# EAGLE board circadian rev2.1 (EAGLE 9.6.2), part 1 of 2
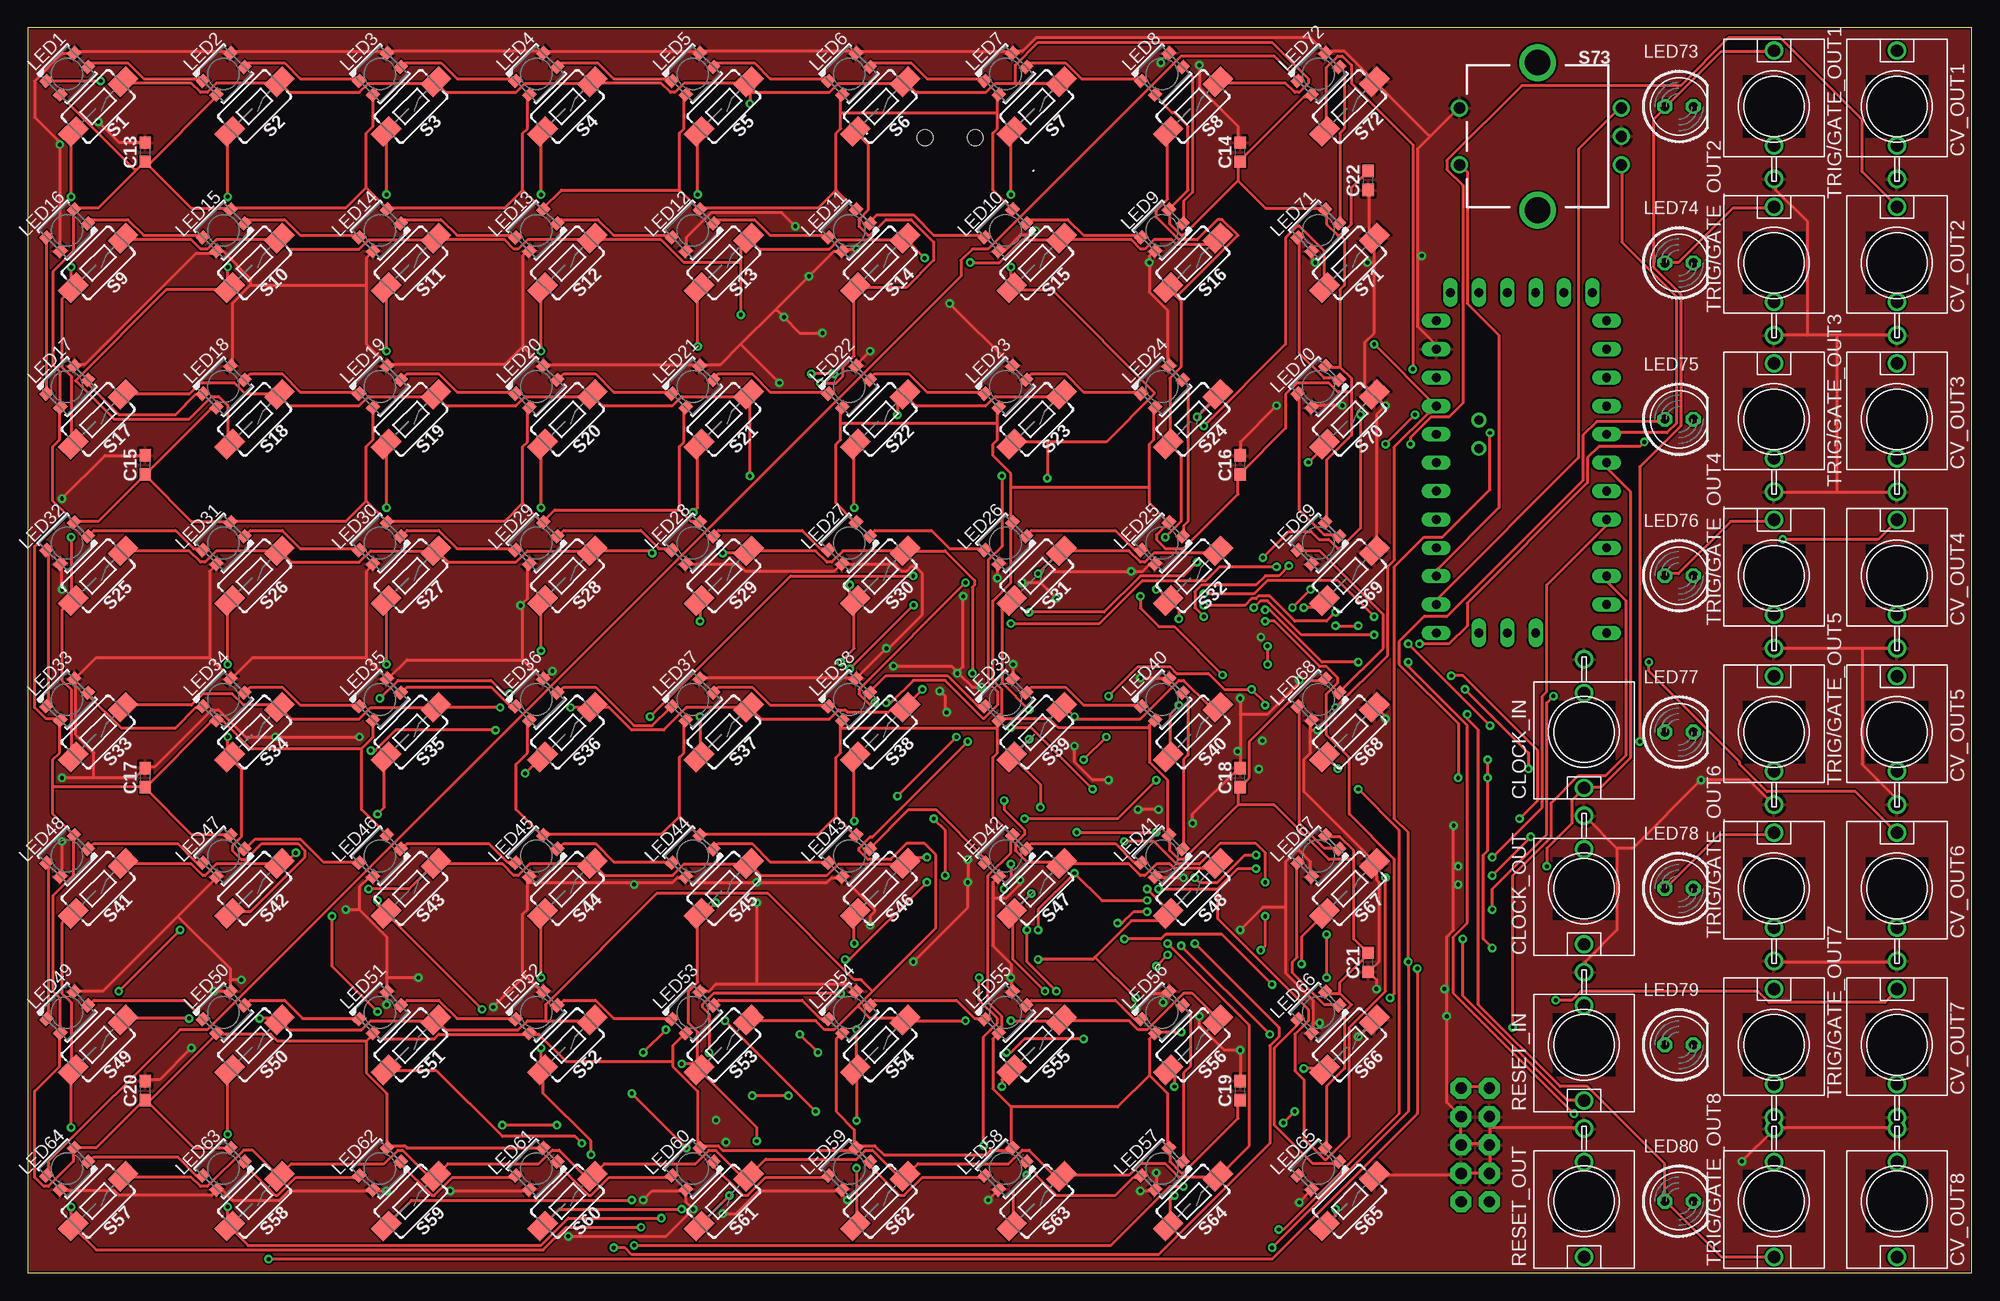
[diagram p6: board, top side]
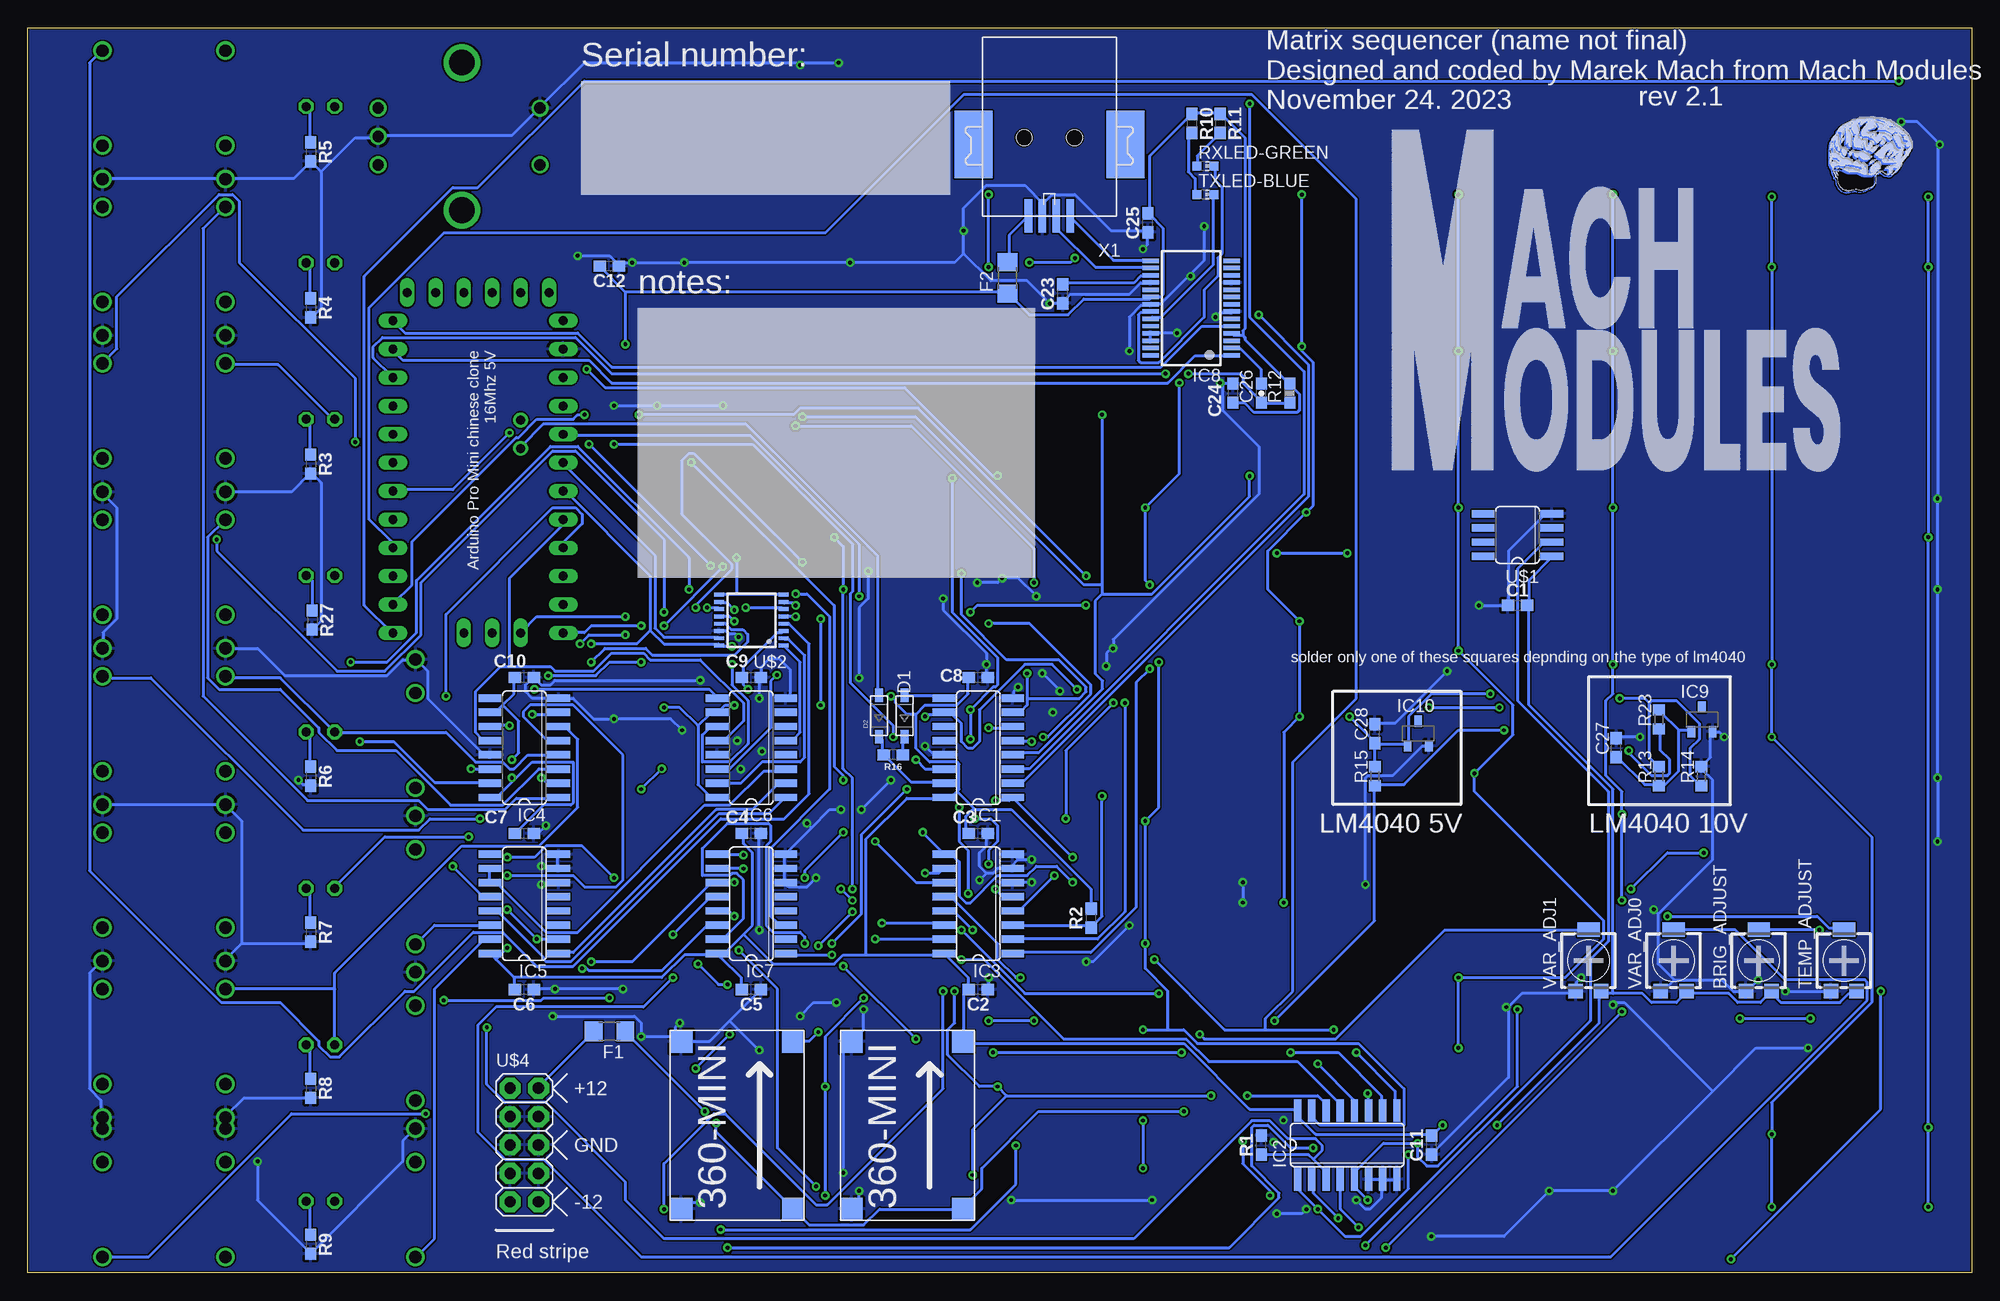
[diagram p7: board, bottom side, seen from below]

Size 173.97 x 111.43 mm. Coordinates in mm from the lower left corner, seen from the top.
Outline: 0,0 173.97,0 173.97,111.43 0,111.43 0,0
Copper layers (1*16): Top 0.035mm / dielectric 0.15mm / Bottom 0.035mm
Design rules "default *": minimum track width 6mil, minimum drill 0.35mm, track to track 6mil, track to pad 6mil, pad to pad 6mil, via to via 6mil, smd to smd 6mil, copper to edge 6mil, drill to drill 6mil, minimum pad ring 10mil, minimum via ring 8mil, stop-mask expansion 4mil, vias tented up to drill 50mil, thermal gap 10mil
Net classes: 0 default: width 0.254 mm; 1 LED_POWER: width 0.305 mm

## Footprints (pad centres in the part's own frame; a part is rotated, then mirrored left to right if it is on the bottom)
RTRIM4G/J = smd 1.3 x 1.3: 1 -1.15,-2.75; 3 1.15,-2.75 | smd 2 x 1.3: 2 0,2.75
0603 = smd 1.1 x 1: 1 -0.85,0; 2 0.85,0
0603-CAP = smd 1.1 x 1: 1 -0.85,0; 2 0.85,0
C0603 = smd 1.1 x 1: 1 -0.85,0; 2 0.85,0
WQP-PJ301M-12_JACK = drill 1.1: P$1 0,5; P$2 0,-3.5; P$3 0,-6.5
SOD-123 = smd 1.2 x 0.7: A 1.85,0; C -1.85,0
1206 = smd 1.6 x 1.803: 1 -1.422,0; 2 1.422,0
SO16 = smd 0.66 x 2.032: 1 -4.445,-3.073; 2 -3.175,-3.073; 3 -1.905,-3.073; 4 -0.635,-3.073; 5 0.635,-3.073; 6 1.905,-3.073; 7 3.175,-3.073; 8 4.445,-3.073; 9 4.445,3.073; 10 3.175,3.073; 11 1.905,3.073; 12 0.635,3.073; 13 -0.635,3.073; 14 -1.905,3.073; 15 -3.175,3.073; 16 -4.445,3.073
SSOP28 = smd 0.4 x 1.5: 1 -4.225,-3.625; 2 -3.575,-3.625; 3 -2.925,-3.625; 4 -2.275,-3.625; 5 -1.625,-3.625; 6 -0.975,-3.625; 7 -0.325,-3.625; 8 0.325,-3.625; 9 0.975,-3.625; 10 1.625,-3.625; 11 2.275,-3.625; 12 2.925,-3.625; 13 3.575,-3.625; 14 4.225,-3.625; 15 4.225,3.625; 16 3.575,3.625; 17 2.925,3.625; 18 2.275,3.625; 19 1.625,3.625; 20 0.975,3.625; 21 0.325,3.625; 22 -0.325,3.625; 23 -0.975,3.625; 24 -1.625,3.625; 25 -2.275,3.625; 26 -2.925,3.625; 27 -3.575,3.625; 28 -4.225,3.625
DBZ_R-PDSO-G3 = smd 0.7 x 1: 1 -0.95,-1.1; 2 0.95,-1.1; 3 0,1.1
LED3535 = smd 1 x 0.85: 1 -1.75,0.875; 2 -1.75,-0.875; 3 1.75,-0.875; 4 1.75,0.875
LED5MM = drill 0.813 octagon: A -1.27,0; K 1.27,0
0603-RES = smd 1.1 x 1: 1 -0.85,0; 2 0.85,0
R0603 = smd 1 x 1.1: 1 -0.85,0; 2 0.85,0
CHIP-LED0603 = smd 0.8 x 0.8: A 0,-0.75; C 0,0.75
TACTILE_SWITCH_SMD_6.0X3.5MM = smd 2.3 x 1.6: 1 -3.15,0; 2 3.15,0
ROTARY_ENC_PLAIN = drill 1.016: A 7.493,-2.54; B 7.493,2.54; C 7.493,0; SW+ -6.985,2.54; SW- -6.985,-2.54 | drill 2.286: P$3 0,6.604; P$4 0,-6.604
SO08 = smd 0.66 x 2.032: 1 -1.905,-3.073; 2 -0.635,-3.073; 3 0.635,-3.073; 4 1.905,-3.073; 5 1.905,3.073; 6 0.635,3.073; 7 -0.635,3.073; 8 -1.905,3.073
TSSOP-16 = smd 0.9 x 0.35: 1 -2.875,2.275; 2 -2.875,1.625; 3 -2.875,0.975; 4 -2.875,0.325; 5 -2.875,-0.325; 6 -2.875,-0.975; 7 -2.875,-1.625; 8 -2.875,-2.275; 9 2.875,-2.275; 10 2.875,-1.625; 11 2.875,-0.975; 12 2.875,-0.325; 13 2.875,0.325; 14 2.875,0.975; 15 2.875,1.625; 16 2.875,2.275
ABK-PRO-MINI = drill 0.8 long: A0 10.16,-11.43; A1 10.16,-8.89; A2 10.16,-6.35; A3 10.16,-3.81; A6 3.81,-21.59; A7 6.35,-21.59; D2 -5.08,-3.81; D3 -5.08,-6.35; D4 -5.08,-8.89; D5 -5.08,-11.43; D6 -5.08,-13.97; D7 -5.08,-16.51; D8 -5.08,-19.05; D9 -5.08,-21.59; D10 10.16,-21.59; D11 10.16,-19.05; D12 10.16,-16.51; D13 10.16,-13.97; DTR -3.81,8.89; GND 10.16,3.81; GND1 -5.08,-1.27; GND2 8.89,8.89; GND3 6.35,8.89; GND4 1.27,-21.59; RAW 10.16,6.35; RST 10.16,1.27; RST1 -5.08,1.27; RX1 -5.08,3.81; RX1-1 1.27,8.89; TX0 -5.08,6.35; TX0-1 -1.27,8.89; VCC 10.16,-1.27; VCC1 3.81,8.89 | drill 0.8: A4 6.35,-5.08; A5 6.35,-2.54
POWER_10 = drill 1.016 pad 1.88 octagon: 1 -5.08,-1.27; 2 -5.08,1.27; 3 -2.54,-1.27; 4 -2.54,1.27; 5 0,-1.27; 6 0,1.27; 7 2.54,-1.27; 8 2.54,1.27; 9 5.08,-1.27; 10 5.08,1.27
MINI-360SMD = smd 2 x 2: +IN -7,-5; +OUT 8,-5; -IN -7,5; -OUT 8,5
USB-B-SMT = smd 6.04 x 3.4: 5 0.58,6.8; 6 0.58,-6.8 | smd 3 x 0.7: D+ 7,1.875; D- 7,0.625; GND 7,-0.625; VUSB 7,-1.875 | hole 1.4: 0,2.25; 0,-2.25

## Placement (x,y rotation side)
BRIG_ADJUST  [RTRIM4G/J]  19.05,27.94 0 bottom
C1  0.1uF  [0603]  40.64,59.75 0 bottom
C2  0.1uF  [0603]  88.9,25.34 180 bottom
C3  0.1uF  [0603]  88.9,39.31 180 bottom
C4  0.1uF  [0603]  109.22,39.31 180 bottom
C5  0.1uF  [0603]  109.22,25.34 180 bottom
C6  0.1uF  [0603]  129.54,25.34 180 bottom
C7  0.1uF  [0603]  129.54,39.31 180 bottom
C8  0.1uF  [0603]  88.9,53.28 180 bottom
C9  0.1uF  [0603]  109.22,53.28 180 bottom
C10  0.1uF  [0603]  129.54,53.28 180 bottom
C11  0.1uF  [0603]  48.32,11.43 90 bottom
C12  0.1uF  [0603]  121.92,90.11 180 bottom
C13  0.1uF  [0603]  10.51,100.31 90 top
C14  0.1uF  [0603]  108.51,100.31 90 top
C15  0.1uF  [0603]  10.51,72.31 90 top
C16  0.1uF  [0603]  108.51,72.31 90 top
C17  0.1uF  [0603]  10.51,44.31 90 top
C18  0.1uF  [0603]  108.51,44.31 90 top
C19  0.1uF  [0603]  108.51,16.31 90 top
C20  0.1uF  [0603]  10.51,16.31 90 top
C21  0.1uF  [0603]  119.97,27.77 90 top
C22  0.1uF  [0603]  119.97,97.77 90 top
C23  0.1uF  [0603]  81.34,87.63 90 bottom
C24  10uF  [0603]  66.1,78.74 90 bottom
C25  0.1uF  [0603]  73.72,93.98 90 bottom
C26  100n  [0603-CAP]  63.56,78.74 90 bottom
C27  470n  [C0603]  31.81,46.99 90 bottom
C28  470n  [C0603]  53.4,48.26 90 bottom
CLOCK_IN  WQP-PJ301M-12_JACK  [WQP-PJ301M-12_JACK]  139.28,48.4 180 top
CLOCK_OUT  WQP-PJ301M-12_JACK  [WQP-PJ301M-12_JACK]  139.28,34.4 180 top
CV_OUT1  WQP-PJ301M-12_JACK  [WQP-PJ301M-12_JACK]  167.29,104.4 0 top
CV_OUT2  WQP-PJ301M-12_JACK  [WQP-PJ301M-12_JACK]  167.29,90.4 0 top
CV_OUT3  WQP-PJ301M-12_JACK  [WQP-PJ301M-12_JACK]  167.29,76.4 0 top
CV_OUT4  WQP-PJ301M-12_JACK  [WQP-PJ301M-12_JACK]  167.29,62.4 0 top
CV_OUT5  WQP-PJ301M-12_JACK  [WQP-PJ301M-12_JACK]  167.29,48.4 0 top
CV_OUT6  WQP-PJ301M-12_JACK  [WQP-PJ301M-12_JACK]  167.29,34.4 0 top
CV_OUT7  WQP-PJ301M-12_JACK  [WQP-PJ301M-12_JACK]  167.29,20.4 0 top
CV_OUT8  WQP-PJ301M-12_JACK  [WQP-PJ301M-12_JACK]  167.29,6.4 180 top
D1  [SOD-123]  95.51,49.85 90 bottom
D2  [SOD-123]  97.79,49.85 90 bottom
F1  PTC-FUSE  [1206]  121.92,21.59 180 bottom
F2  PTC-FUSE  [1206]  86.3,89.05 90 bottom
IC1  4017D  [SO16]  88.9,46.99 90 bottom
IC2  4051D  [SO16]  55.88,11.43 0 bottom
IC3  4051D  [SO16]  88.9,33.02 90 bottom
IC4  74HC595D  [SO16]  129.54,46.99 90 bottom
IC5  4053D  [SO16]  129.54,33.02 90 bottom
IC6  74HC595D  [SO16]  109.22,46.99 90 bottom
IC7  4051D  [SO16]  109.22,33.02 90 bottom
IC8  FT232RL  [SSOP28]  69.85,86.36 90 bottom
IC9  LM4040B10  [DBZ_R-PDSO-G3]  24.13,49.53 0 bottom
IC10  LM4040B05  [DBZ_R-PDSO-G3]  49.53,48.26 0 bottom
LED1  SK68123535  [LED3535]  3.51,107.31 45 top
LED2  SK68123535  [LED3535]  17.51,107.31 45 top
LED3  SK68123535  [LED3535]  31.51,107.31 45 top
LED4  SK68123535  [LED3535]  45.51,107.31 45 top
LED5  SK68123535  [LED3535]  59.51,107.31 45 top
LED6  SK68123535  [LED3535]  73.51,107.31 45 top
LED7  SK68123535  [LED3535]  87.51,107.31 45 top
LED8  SK68123535  [LED3535]  101.51,107.31 45 top
LED9  SK68123535  [LED3535]  101.51,93.31 225 top
LED10  SK68123535  [LED3535]  87.51,93.31 225 top
LED11  SK68123535  [LED3535]  73.51,93.31 225 top
LED12  SK68123535  [LED3535]  59.51,93.31 225 top
LED13  SK68123535  [LED3535]  45.51,93.31 225 top
LED14  SK68123535  [LED3535]  31.51,93.31 225 top
LED15  SK68123535  [LED3535]  17.51,93.31 225 top
LED16  SK68123535  [LED3535]  3.51,93.31 225 top
LED17  SK68123535  [LED3535]  3.51,79.31 45 top
LED18  SK68123535  [LED3535]  17.51,79.31 45 top
LED19  SK68123535  [LED3535]  31.51,79.31 45 top
LED20  SK68123535  [LED3535]  45.51,79.31 45 top
LED21  SK68123535  [LED3535]  59.51,79.31 45 top
LED22  SK68123535  [LED3535]  73.51,79.31 45 top
LED23  SK68123535  [LED3535]  87.51,79.31 45 top
LED24  SK68123535  [LED3535]  101.51,79.31 45 top
LED25  SK68123535  [LED3535]  101.51,65.31 225 top
LED26  SK68123535  [LED3535]  87.51,65.31 225 top
LED27  SK68123535  [LED3535]  73.51,65.31 225 top
LED28  SK68123535  [LED3535]  59.51,65.31 225 top
LED29  SK68123535  [LED3535]  45.51,65.31 225 top
LED30  SK68123535  [LED3535]  31.51,65.31 225 top
LED31  SK68123535  [LED3535]  17.51,65.31 225 top
LED32  SK68123535  [LED3535]  3.51,65.31 225 top
LED33  SK68123535  [LED3535]  3.51,51.31 45 top
LED34  SK68123535  [LED3535]  17.51,51.31 45 top
LED35  SK68123535  [LED3535]  31.51,51.31 45 top
LED36  SK68123535  [LED3535]  45.51,51.31 45 top
LED37  SK68123535  [LED3535]  59.51,51.31 45 top
LED38  SK68123535  [LED3535]  73.51,51.31 45 top
LED39  SK68123535  [LED3535]  87.51,51.31 45 top
LED40  SK68123535  [LED3535]  101.51,51.31 45 top
LED41  SK68123535  [LED3535]  101.51,37.31 225 top
LED42  SK68123535  [LED3535]  87.51,37.31 225 top
LED43  SK68123535  [LED3535]  73.51,37.31 225 top
LED44  SK68123535  [LED3535]  59.51,37.31 225 top
LED45  SK68123535  [LED3535]  45.51,37.31 225 top
LED46  SK68123535  [LED3535]  31.51,37.31 225 top
LED47  SK68123535  [LED3535]  17.51,37.31 225 top
LED48  SK68123535  [LED3535]  3.51,37.31 225 top
LED49  SK68123535  [LED3535]  3.51,23.31 45 top
LED50  SK68123535  [LED3535]  17.51,23.31 45 top
LED51  SK68123535  [LED3535]  31.51,23.31 45 top
LED52  SK68123535  [LED3535]  45.51,23.31 45 top
LED53  SK68123535  [LED3535]  59.51,23.31 45 top
LED54  SK68123535  [LED3535]  73.51,23.31 45 top
LED55  SK68123535  [LED3535]  87.51,23.31 45 top
LED56  SK68123535  [LED3535]  101.51,23.31 45 top
LED57  SK68123535  [LED3535]  101.51,9.31 225 top
LED58  SK68123535  [LED3535]  87.51,9.31 225 top
LED59  SK68123535  [LED3535]  73.51,9.31 225 top
LED60  SK68123535  [LED3535]  59.51,9.31 225 top
LED61  SK68123535  [LED3535]  45.51,9.31 225 top
LED62  SK68123535  [LED3535]  31.51,9.31 225 top
LED63  SK68123535  [LED3535]  17.51,9.31 225 top
LED64  SK68123535  [LED3535]  3.51,9.31 225 top
LED65  SK68123535  [LED3535]  115.51,9.31 225 top
LED66  SK68123535  [LED3535]  115.51,23.31 225 top
LED67  SK68123535  [LED3535]  115.51,37.31 225 top
LED68  SK68123535  [LED3535]  115.51,51.31 225 top
LED69  SK68123535  [LED3535]  115.51,65.31 225 top
LED70  SK68123535  [LED3535]  115.51,79.31 225 top
LED71  SK68123535  [LED3535]  115.51,93.31 225 top
LED72  SK68123535  [LED3535]  115.51,107.31 45 top
LED73  [LED5MM]  147.79,104.4 0 top
LED74  [LED5MM]  147.79,90.4 0 top
LED75  [LED5MM]  147.79,76.4 0 top
LED76  [LED5MM]  147.79,62.4 0 top
LED77  [LED5MM]  147.79,48.4 0 top
LED78  [LED5MM]  147.79,34.4 0 top
LED79  [LED5MM]  147.79,20.4 0 top
LED80  [LED5MM]  147.79,6.4 0 top
R1  10k  [0603]  63.56,11.43 90 bottom
R2  10k  [0603]  78.8,31.75 90 bottom
R3  470  [0603]  148.65,72.39 270 bottom
R4  470  [0603]  148.65,86.36 270 bottom
R5  470  [0603]  148.65,100.33 270 bottom
R6  470  [0603]  148.65,44.45 270 bottom
R7  470  [0603]  148.65,30.48 270 bottom
R8  470  [0603]  148.65,16.51 270 bottom
R9  470  [0603]  148.65,2.54 270 bottom
R10  470  [0603]  69.79,102.87 270 bottom
R11  470  [0603]  67.25,102.87 270 bottom
R12  10K  [0603-RES]  61.02,78.74 90 bottom
R13  1.0k  [R0603]  28,44.45 90 bottom
R14  1.0k  [R0603]  24.19,44.45 90 bottom
R15  1.0k  [R0603]  53.4,44.45 90 bottom
R16  1k  [0603]  96.52,46.35 180 bottom
R23  1.0k  [R0603]  28,49.53 90 bottom
R27  470  [0603]  148.53,58.42 270 bottom
RESET_IN  WQP-PJ301M-12_JACK  [WQP-PJ301M-12_JACK]  139.28,20.4 180 top
RESET_OUT  WQP-PJ301M-12_JACK  [WQP-PJ301M-12_JACK]  139.28,6.4 180 top
RXLED-GREEN  [CHIP-LED0603]  68.58,99.06 270 bottom
S1  MOMENTARY-SWITCH-SPST-SMD-6.0X3.5MM  [TACTILE_SWITCH_SMD_6.0X3.5MM]  6.29,104.4 225 top
S2  MOMENTARY-SWITCH-SPST-SMD-6.0X3.5MM  [TACTILE_SWITCH_SMD_6.0X3.5MM]  20.29,104.4 225 top
S3  MOMENTARY-SWITCH-SPST-SMD-6.0X3.5MM  [TACTILE_SWITCH_SMD_6.0X3.5MM]  34.29,104.4 225 top
S4  MOMENTARY-SWITCH-SPST-SMD-6.0X3.5MM  [TACTILE_SWITCH_SMD_6.0X3.5MM]  48.29,104.4 225 top
S5  MOMENTARY-SWITCH-SPST-SMD-6.0X3.5MM  [TACTILE_SWITCH_SMD_6.0X3.5MM]  62.29,104.4 225 top
S6  MOMENTARY-SWITCH-SPST-SMD-6.0X3.5MM  [TACTILE_SWITCH_SMD_6.0X3.5MM]  76.29,104.4 225 top
S7  MOMENTARY-SWITCH-SPST-SMD-6.0X3.5MM  [TACTILE_SWITCH_SMD_6.0X3.5MM]  90.29,104.4 225 top
S8  MOMENTARY-SWITCH-SPST-SMD-6.0X3.5MM  [TACTILE_SWITCH_SMD_6.0X3.5MM]  104.29,104.4 225 top
S9  MOMENTARY-SWITCH-SPST-SMD-6.0X3.5MM  [TACTILE_SWITCH_SMD_6.0X3.5MM]  6.29,90.4 225 top
S10  MOMENTARY-SWITCH-SPST-SMD-6.0X3.5MM  [TACTILE_SWITCH_SMD_6.0X3.5MM]  20.29,90.4 225 top
S11  MOMENTARY-SWITCH-SPST-SMD-6.0X3.5MM  [TACTILE_SWITCH_SMD_6.0X3.5MM]  34.29,90.4 225 top
S12  MOMENTARY-SWITCH-SPST-SMD-6.0X3.5MM  [TACTILE_SWITCH_SMD_6.0X3.5MM]  48.29,90.4 225 top
S13  MOMENTARY-SWITCH-SPST-SMD-6.0X3.5MM  [TACTILE_SWITCH_SMD_6.0X3.5MM]  62.29,90.4 225 top
S14  MOMENTARY-SWITCH-SPST-SMD-6.0X3.5MM  [TACTILE_SWITCH_SMD_6.0X3.5MM]  76.29,90.4 225 top
S15  MOMENTARY-SWITCH-SPST-SMD-6.0X3.5MM  [TACTILE_SWITCH_SMD_6.0X3.5MM]  90.29,90.4 225 top
S16  MOMENTARY-SWITCH-SPST-SMD-6.0X3.5MM  [TACTILE_SWITCH_SMD_6.0X3.5MM]  104.29,90.4 225 top
S17  MOMENTARY-SWITCH-SPST-SMD-6.0X3.5MM  [TACTILE_SWITCH_SMD_6.0X3.5MM]  6.29,76.4 225 top
S18  MOMENTARY-SWITCH-SPST-SMD-6.0X3.5MM  [TACTILE_SWITCH_SMD_6.0X3.5MM]  20.29,76.4 225 top
S19  MOMENTARY-SWITCH-SPST-SMD-6.0X3.5MM  [TACTILE_SWITCH_SMD_6.0X3.5MM]  34.29,76.4 225 top
S20  MOMENTARY-SWITCH-SPST-SMD-6.0X3.5MM  [TACTILE_SWITCH_SMD_6.0X3.5MM]  48.29,76.4 225 top
S21  MOMENTARY-SWITCH-SPST-SMD-6.0X3.5MM  [TACTILE_SWITCH_SMD_6.0X3.5MM]  62.29,76.4 225 top
S22  MOMENTARY-SWITCH-SPST-SMD-6.0X3.5MM  [TACTILE_SWITCH_SMD_6.0X3.5MM]  76.29,76.4 225 top
S23  MOMENTARY-SWITCH-SPST-SMD-6.0X3.5MM  [TACTILE_SWITCH_SMD_6.0X3.5MM]  90.29,76.4 225 top
S24  MOMENTARY-SWITCH-SPST-SMD-6.0X3.5MM  [TACTILE_SWITCH_SMD_6.0X3.5MM]  104.29,76.4 225 top
S25  MOMENTARY-SWITCH-SPST-SMD-6.0X3.5MM  [TACTILE_SWITCH_SMD_6.0X3.5MM]  6.29,62.4 225 top
S26  MOMENTARY-SWITCH-SPST-SMD-6.0X3.5MM  [TACTILE_SWITCH_SMD_6.0X3.5MM]  20.29,62.4 225 top
S27  MOMENTARY-SWITCH-SPST-SMD-6.0X3.5MM  [TACTILE_SWITCH_SMD_6.0X3.5MM]  34.29,62.4 225 top
S28  MOMENTARY-SWITCH-SPST-SMD-6.0X3.5MM  [TACTILE_SWITCH_SMD_6.0X3.5MM]  48.29,62.4 225 top
S29  MOMENTARY-SWITCH-SPST-SMD-6.0X3.5MM  [TACTILE_SWITCH_SMD_6.0X3.5MM]  62.29,62.4 225 top
S30  MOMENTARY-SWITCH-SPST-SMD-6.0X3.5MM  [TACTILE_SWITCH_SMD_6.0X3.5MM]  76.29,62.4 225 top
S31  MOMENTARY-SWITCH-SPST-SMD-6.0X3.5MM  [TACTILE_SWITCH_SMD_6.0X3.5MM]  90.29,62.4 225 top
S32  MOMENTARY-SWITCH-SPST-SMD-6.0X3.5MM  [TACTILE_SWITCH_SMD_6.0X3.5MM]  104.29,62.4 225 top
S33  MOMENTARY-SWITCH-SPST-SMD-6.0X3.5MM  [TACTILE_SWITCH_SMD_6.0X3.5MM]  6.29,48.4 225 top
S34  MOMENTARY-SWITCH-SPST-SMD-6.0X3.5MM  [TACTILE_SWITCH_SMD_6.0X3.5MM]  20.29,48.4 225 top
S35  MOMENTARY-SWITCH-SPST-SMD-6.0X3.5MM  [TACTILE_SWITCH_SMD_6.0X3.5MM]  34.29,48.4 225 top
S36  MOMENTARY-SWITCH-SPST-SMD-6.0X3.5MM  [TACTILE_SWITCH_SMD_6.0X3.5MM]  48.29,48.4 225 top
S37  MOMENTARY-SWITCH-SPST-SMD-6.0X3.5MM  [TACTILE_SWITCH_SMD_6.0X3.5MM]  62.29,48.4 225 top
S38  MOMENTARY-SWITCH-SPST-SMD-6.0X3.5MM  [TACTILE_SWITCH_SMD_6.0X3.5MM]  76.29,48.4 225 top
S39  MOMENTARY-SWITCH-SPST-SMD-6.0X3.5MM  [TACTILE_SWITCH_SMD_6.0X3.5MM]  90.29,48.4 225 top
S40  MOMENTARY-SWITCH-SPST-SMD-6.0X3.5MM  [TACTILE_SWITCH_SMD_6.0X3.5MM]  104.29,48.4 225 top
S41  MOMENTARY-SWITCH-SPST-SMD-6.0X3.5MM  [TACTILE_SWITCH_SMD_6.0X3.5MM]  6.29,34.4 225 top
S42  MOMENTARY-SWITCH-SPST-SMD-6.0X3.5MM  [TACTILE_SWITCH_SMD_6.0X3.5MM]  20.29,34.4 225 top
S43  MOMENTARY-SWITCH-SPST-SMD-6.0X3.5MM  [TACTILE_SWITCH_SMD_6.0X3.5MM]  34.29,34.4 225 top
S44  MOMENTARY-SWITCH-SPST-SMD-6.0X3.5MM  [TACTILE_SWITCH_SMD_6.0X3.5MM]  48.29,34.4 225 top
S45  MOMENTARY-SWITCH-SPST-SMD-6.0X3.5MM  [TACTILE_SWITCH_SMD_6.0X3.5MM]  62.29,34.4 225 top
S46  MOMENTARY-SWITCH-SPST-SMD-6.0X3.5MM  [TACTILE_SWITCH_SMD_6.0X3.5MM]  76.29,34.4 225 top
S47  MOMENTARY-SWITCH-SPST-SMD-6.0X3.5MM  [TACTILE_SWITCH_SMD_6.0X3.5MM]  90.29,34.4 225 top
S48  MOMENTARY-SWITCH-SPST-SMD-6.0X3.5MM  [TACTILE_SWITCH_SMD_6.0X3.5MM]  104.29,34.4 225 top
S49  MOMENTARY-SWITCH-SPST-SMD-6.0X3.5MM  [TACTILE_SWITCH_SMD_6.0X3.5MM]  6.29,20.4 225 top
S50  MOMENTARY-SWITCH-SPST-SMD-6.0X3.5MM  [TACTILE_SWITCH_SMD_6.0X3.5MM]  20.29,20.4 225 top
S51  MOMENTARY-SWITCH-SPST-SMD-6.0X3.5MM  [TACTILE_SWITCH_SMD_6.0X3.5MM]  34.29,20.4 225 top
S52  MOMENTARY-SWITCH-SPST-SMD-6.0X3.5MM  [TACTILE_SWITCH_SMD_6.0X3.5MM]  48.29,20.4 225 top
S53  MOMENTARY-SWITCH-SPST-SMD-6.0X3.5MM  [TACTILE_SWITCH_SMD_6.0X3.5MM]  62.29,20.4 225 top
S54  MOMENTARY-SWITCH-SPST-SMD-6.0X3.5MM  [TACTILE_SWITCH_SMD_6.0X3.5MM]  76.29,20.4 225 top
S55  MOMENTARY-SWITCH-SPST-SMD-6.0X3.5MM  [TACTILE_SWITCH_SMD_6.0X3.5MM]  90.29,20.4 225 top
S56  MOMENTARY-SWITCH-SPST-SMD-6.0X3.5MM  [TACTILE_SWITCH_SMD_6.0X3.5MM]  104.29,20.4 225 top
S57  MOMENTARY-SWITCH-SPST-SMD-6.0X3.5MM  [TACTILE_SWITCH_SMD_6.0X3.5MM]  6.29,6.4 225 top
S58  MOMENTARY-SWITCH-SPST-SMD-6.0X3.5MM  [TACTILE_SWITCH_SMD_6.0X3.5MM]  20.29,6.4 225 top
S59  MOMENTARY-SWITCH-SPST-SMD-6.0X3.5MM  [TACTILE_SWITCH_SMD_6.0X3.5MM]  34.29,6.4 225 top
S60  MOMENTARY-SWITCH-SPST-SMD-6.0X3.5MM  [TACTILE_SWITCH_SMD_6.0X3.5MM]  48.29,6.4 225 top
S61  MOMENTARY-SWITCH-SPST-SMD-6.0X3.5MM  [TACTILE_SWITCH_SMD_6.0X3.5MM]  62.29,6.4 225 top
S62  MOMENTARY-SWITCH-SPST-SMD-6.0X3.5MM  [TACTILE_SWITCH_SMD_6.0X3.5MM]  76.29,6.4 225 top
S63  MOMENTARY-SWITCH-SPST-SMD-6.0X3.5MM  [TACTILE_SWITCH_SMD_6.0X3.5MM]  90.29,6.4 225 top
S64  MOMENTARY-SWITCH-SPST-SMD-6.0X3.5MM  [TACTILE_SWITCH_SMD_6.0X3.5MM]  104.29,6.4 225 top
S65  MOMENTARY-SWITCH-SPST-SMD-6.0X3.5MM  [TACTILE_SWITCH_SMD_6.0X3.5MM]  118.29,6.4 225 top
S66  MOMENTARY-SWITCH-SPST-SMD-6.0X3.5MM  [TACTILE_SWITCH_SMD_6.0X3.5MM]  118.29,20.4 225 top
S67  MOMENTARY-SWITCH-SPST-SMD-6.0X3.5MM  [TACTILE_SWITCH_SMD_6.0X3.5MM]  118.29,34.4 225 top
S68  MOMENTARY-SWITCH-SPST-SMD-6.0X3.5MM  [TACTILE_SWITCH_SMD_6.0X3.5MM]  118.29,48.4 225 top
S69  MOMENTARY-SWITCH-SPST-SMD-6.0X3.5MM  [TACTILE_SWITCH_SMD_6.0X3.5MM]  118.29,62.4 225 top
S70  MOMENTARY-SWITCH-SPST-SMD-6.0X3.5MM  [TACTILE_SWITCH_SMD_6.0X3.5MM]  118.29,76.4 225 top
S71  MOMENTARY-SWITCH-SPST-SMD-6.0X3.5MM  [TACTILE_SWITCH_SMD_6.0X3.5MM]  118.29,90.4 225 top
S72  MOMENTARY-SWITCH-SPST-SMD-6.0X3.5MM  [TACTILE_SWITCH_SMD_6.0X3.5MM]  118.29,104.4 225 top
S73  ENCODER-SWITCH  [ROTARY_ENC_PLAIN]  135.13,101.72 0 top
TEMP_ADJUST  [RTRIM4G/J]  11.43,27.94 0 bottom
TRIG/GATE_OUT1  WQP-PJ301M-12_JACK  [WQP-PJ301M-12_JACK]  156.29,104.4 0 top
TRIG/GATE_OUT2  WQP-PJ301M-12_JACK  [WQP-PJ301M-12_JACK]  156.29,90.4 0 top
TRIG/GATE_OUT3  WQP-PJ301M-12_JACK  [WQP-PJ301M-12_JACK]  156.29,76.4 0 top
TRIG/GATE_OUT4  WQP-PJ301M-12_JACK  [WQP-PJ301M-12_JACK]  156.29,62.4 0 top
TRIG/GATE_OUT5  WQP-PJ301M-12_JACK  [WQP-PJ301M-12_JACK]  156.29,48.4 0 top
TRIG/GATE_OUT6  WQP-PJ301M-12_JACK  [WQP-PJ301M-12_JACK]  156.29,34.4 0 top
TRIG/GATE_OUT7  WQP-PJ301M-12_JACK  [WQP-PJ301M-12_JACK]  156.29,20.4 0 top
TRIG/GATE_OUT8  WQP-PJ301M-12_JACK  [WQP-PJ301M-12_JACK]  156.29,6.4 180 top
TXLED-BLUE  [CHIP-LED0603]  68.58,96.52 270 bottom
U$1  AD22100  [SO08]  40.64,66.04 90 bottom
U$2  AD5328  [TSSOP-16]  109.22,58.42 180 bottom
U$3  ABK-PRO-MINI  [ABK-PRO-MINI]  136.22,78.86 0 bottom
U$4  POWER_SIMPLE10  [POWER_10]  129.54,11.43 90 bottom
U$5  MINI-360SMD  [MINI-360SMD]  110.49,12.7 90 bottom
U$6  MINI-360SMD  [MINI-360SMD]  95.25,12.7 90 bottom
VAR_ADJ0  [RTRIM4G/J]  26.67,27.94 0 bottom
VAR_ADJ1  [RTRIM4G/J]  34.29,27.94 0 bottom
X1  [USB-B-SMT]  82.55,101.6 270 bottom

## Tracks (layer width: path | path; a pad name or v marks a point on that pad's centre or on a via)
5V_REF  (via drill 0.35)
  Top 0.254: v43.08,51.82 42.67,51.82 41.45,53.03 33.12,53.03 v31.5,51.41 | v119.28,76.81 119.28,66.65 117.45,64.82 117.25,64.82 116.43,65.63 115.57,65.63 114.85,66.36 112.89,66.36 v110.54,64.01 | v79.25,62.38 68.28,62.38 v55.68,49.78
  Bottom 0.254: 110.54,60.76 111.96,60.76 U$2.9 | 110.54,60.76 106.48,60.76 U$2.8 | C28.1 53.24,47.35 50.6,47.35 IC10.1 50.39,47.35 50.39,49.78 48.36,51.82 v43.08,51.82 | R15.2 53.44,45.31 53.44,47.35 C28.1 | 28.85,51 28.65,51.21 26.42,51.21 24.38,49.17 24.38,47.75 25.2,46.94 25.2,44.5 24.38,43.69 R14.1 | 28.85,51 28.85,46.13 28.04,45.31 R13.2 | v31.5,51.41 29.26,51.41 28.85,51 | v110.54,64.01 110.54,60.76 | v119.28,76.81 105.46,76.81 104.85,77.42 94.28,77.42 v79.25,62.38 | v55.68,49.78 53.44,47.55 C28.1
+5V  (via drill 0.35)
  Top 0.254: v120.5,83.11 125.98,77.62 U$3.VCC 125.98,77.42 125.58,77.01 125.37,77.01 122.33,73.97 122.33,63.8 121.72,63.2 121.72,55.27 v117.04,50.6 | v110.74,50.8 110.74,51 v109.53,52.22 107.09,52.22 105.66,53.65 102.82,53.65 102.21,54.25 99.36,54.25 v96.72,51.61 | v130.66,45.92 v130.66,44.3 130.66,37.8 130.25,37.39 130.25,29.87 v131.06,29.06 | v47.35,13.21 v42.47,13.21
  Bottom 0.254: 65.23,83.92 65.02,83.72 65.02,83.52 61.16,79.65 R12.2 60.96,79.45 60.15,78.64 60.15,77.22 60.35,77.01 64.21,77.01 65.02,77.83 66.04,77.83 C24.1 | 65.23,83.92 66.04,83.92 IC8.4 | 65.23,83.92 65.23,84.33 65.02,84.53 65.02,101.6 67.06,103.63 R11.1 67.26,103.83 69.7,103.83 R10.1 69.9,103.63 73.56,99.97 73.56,94.89 C25.2 73.56,94.69 72.34,93.47 72.34,87.58 72.54,87.38 73.36,87.38 IC8.20 73.56,87.17 79.45,87.17 80.87,85.75 84.33,85.75 86.16,87.58 F2.1 86.36,87.78 120.5,87.78 | 120.5,87.78 122.73,90.02 C12.2 | 120.5,87.78 v120.5,83.11 | U$1.1 37.59,64.01 39.62,61.98 39.62,59.94 C1.2 39.62,59.74 39.62,50.8 32.11,43.28 32.11,24.99 | TEMP_ADJUST.3 10.36,24.99 10.97,24.99 11.79,24.18 17.07,24.18 17.88,24.99 BRIG_ADJUST.3 18.09,24.99 18.9,24.18 20.93,24.18 21.74,24.99 25.4,24.99 VAR_ADJ0.3 25.6,24.99 26.42,24.18 28.65,24.18 29.46,24.99 32.11,24.99 | 32.11,24.99 33.12,24.99 VAR_ADJ1.3 33.33,24.99 33.33,22.35 v42.47,13.21 | U$2.3 106.48,57.3 106.88,57.3 109.93,54.25 109.93,53.44 C9.2 109.93,53.24 109.93,52.63 v109.53,52.22 | 114,48.97 114,43.69 112.98,42.67 112.37,42.67 IC6.16 | 114,48.97 112.98,49.99 112.37,49.99 IC6.10 112.17,50.19 111.56,50.8 v110.74,50.8 | 94.49,49.99 93.67,50.8 90.83,50.8 89.81,51.82 89.81,53.24 C8.2 | 94.49,49.99 94.49,46.94 93.27,45.72 90.83,45.72 90.63,45.52 90.63,43.28 90.83,43.08 | 90.83,43.08 91.24,42.67 91.85,42.67 IC1.16 92.05,42.47 95.3,42.47 98.96,38.81 98.96,28.45 | 89.2,41.45 89.41,41.45 90.02,40.84 90.02,39.62 89.81,39.42 C3.2 | 89.2,41.45 85.95,41.45 78.84,34.34 78.84,32.72 R2.2 | 89.2,41.45 90.83,43.08
  Bottom 0.254: v96.72,51.61 96.32,51.21 96.32,51 95.3,49.99 94.49,49.99 | 131.47,50.8 132.08,50.19 132.49,50.19 IC4.10 | 131.47,50.8 130.45,51.82 130.45,53.24 C10.2 | 130.45,44.09 131.88,42.67 132.49,42.67 IC4.16 | 130.45,44.09 128.83,45.72 125.17,45.72 125.17,42.06 125.37,41.86 127.81,41.86 130.25,39.42 C7.2 | 131.47,50.8 130.05,49.38 130.05,46.53 v130.66,45.92 | 130.45,44.09 v130.66,44.3 | 130.45,26.42 130.45,25.4 C6.2 | IC5.16 132.08,28.04 | 132.08,28.04 130.45,26.42 | 111.96,28.25 IC7.16 112.37,28.45 115.21,28.45 117.25,26.42 130.45,26.42 | 111.96,28.25 110.13,26.42 110.13,25.4 C5.2 | 111.96,28.25 109.93,30.28 | 109.93,30.28 109.12,31.09 109.12,37.59 109.93,38.41 109.93,39.22 C4.2 | 98.96,28.45 100.99,28.45 101.8,27.64 107.29,27.64 109.93,30.28 | 98.96,28.45 92.05,28.45 IC3.16 89.81,26.42 89.81,25.4 C2.2 89.81,25.2 90.22,24.79 90.22,20.73 U$6.+OUT 90.22,20.52 70.51,20.52 64.62,14.63 60.35,14.63 IC2.16 60.15,14.43 60.15,13.82 58.73,12.39 48.36,12.39 C11.2 48.16,12.39 v47.35,13.21 | 132.08,28.04 v131.06,29.06 | v117.04,50.6 115.62,50.6 114,48.97
+12V  (via drill 0.35)
  Top 0.254: v30.68,46.74 31.09,46.74 32.92,48.56 v41.86,48.56 | v112.37,13.41 v113.39,14.43 | v70.51,14.43 v62.38,22.55
  Bottom 0.254: v30.68,46.74 30.68,46.53 28.65,44.5 27.23,44.5 27.03,44.7 27.03,45.92 27.84,46.74 27.84,48.56 R23.1 | v41.86,48.56 45.92,48.56 50.8,43.69 53.24,43.69 R15.1 53.44,43.48 53.44,31.5 v62.38,22.55 | v113.39,14.43 120.5,21.54 F1.1 | v112.37,13.41 112.37,12.6 105.66,5.89 U$5.+IN 105.46,5.69 104.04,4.27 99.16,4.27 97.74,5.69 90.42,5.69 U$6.+IN 90.22,5.89 88.59,7.52 88.59,9.35 83.52,14.43 v70.51,14.43
ANALOG_MUX  (via drill 0.35)
  Top 0.254: v105.26,60.76 109.73,60.76 110.95,61.98 117.25,61.98 v120.5,58.73
  Bottom 0.254: v105.26,60.76 104.24,60.76 102.21,58.73 102.21,43.28 107.49,38 107.49,31.9 106.88,31.29 106.27,31.29 IC7.3 | v120.5,58.73 128.42,58.73 129.84,57.3 U$3.A7
AREF
  Bottom 0.254: 26.21,48.56 25.2,48.56 IC9.1 | 26.21,48.56 27.84,50.19 R23.2 | C27.1 31.7,46.13 29.26,43.69 28.04,43.69 R13.1 27.84,43.69 27.43,43.69 26.21,44.91 26.21,48.56
BRIGHTNESS_ADJ  (via drill 0.35)
  Top 0.254: v8.13,25.2 v13.61,30.68 | v21.54,1.22 111.35,1.22 124.36,14.22 v124.36,27.23
  Bottom 0.254: v13.61,30.68 18.9,30.68 BRIG_ADJUST.2 | v8.13,25.2 8.13,14.63 v21.54,1.22 | v124.36,27.23 123.95,27.23 123.75,27.03 117.25,27.03 113.18,31.09 112.37,31.09 IC7.14
BUTTON_CONTROL_OUT  (via drill 0.35)
  Top 0.254: v117.04,57.91 v119.08,57.91 | v111.76,63.2 106.68,63.2 105.46,61.98 99.77,61.98 95.91,58.12 v87.99,58.12 | v77.83,42.67 v83.11,47.95
  Bottom 0.254: IC3.3 85.75,31.09 78.84,31.09 R2.1 78.64,31.09 77.83,31.9 v77.83,42.67 | v119.08,57.91 123.55,57.91 124.16,57.3 125.98,57.3 U$3.D10 | v111.76,63.2 v117.04,57.91 | v87.99,58.12 84.33,58.12 78.84,52.63 78.84,51.82 82.7,47.95 v83.11,47.95
BUTTON_MATRIX_COLLUM1  (via drill 0.35)
  Top 0.254: S33.2 3.86,46.33 3.86,52.22 3.05,53.03 3.05,59.33 3.86,60.15 S25.2 3.86,60.35 v3.86,65.84 | S17.2 3.86,74.37 3.86,80.26 3.05,81.08 3.05,87.17 3.86,87.99 S9.2 3.86,88.19 v3.86,90.02 | v3.86,96.32 3.86,102.01 S1.2 | S41.2 3.86,32.11 3.05,31.29 3.05,24.99 3.86,24.18 3.86,18.29 S49.2 3.86,18.09 v3.86,13.01 | v54.86,4.06 48.16,4.06 46.13,2.03 6.1,2.03 4.06,4.06 S57.2 3.86,4.27 v3.86,5.89
  Bottom 0.254: v3.86,96.32 v3.86,90.02 v3.86,65.84 v3.86,13.01 v3.86,5.89 | v54.86,4.06 56.49,5.69 56.49,8.33 IC2.4
BUTTON_MATRIX_COLLUM2  (via drill 0.35)
  Top 0.254: v56.69,4.88 48.36,4.88 45.92,2.44 19.71,2.44 18.09,4.06 S58.2 17.88,4.27 v17.88,5.89 | v17.88,12.39 17.88,18.09 S50.2 | S42.2 18.09,32.31 19.91,32.31 24.79,37.19 24.79,37.8 24.18,38.41 20.93,38.41 19.51,36.98 19.1,36.98 18.29,37.8 18.29,38.2 19.1,39.01 19.1,45.11 18.09,46.13 S34.2 17.88,46.33 v17.88,47.95 | v17.88,54.46 17.88,60.15 S26.2 | S18.2 17.88,74.37 17.88,77.62 17.07,78.44 16.46,78.44 14.43,76.4 7.72,76.4 4.27,79.86 12.39,87.99 17.88,87.99 S10.2 17.88,88.19 v17.88,90.02 | v17.88,96.32 17.88,102.01 S2.2
  Bottom 0.254: v56.69,4.88 58.93,7.11 58.93,8.33 IC2.2 | v17.88,5.89 v17.88,12.39 17.88,15.24 8.94,24.18 8.94,39.01 v17.88,47.95 v17.88,54.46 v17.88,90.02 v17.88,96.32
BUTTON_MATRIX_COLLUM3  (via drill 0.35)
  Top 0.254: v54.05,6.5 34.34,6.5 32.11,4.27 S59.2 | v49.58,11.58 48.97,12.19 42.47,12.19 36.58,18.09 32.11,18.09 S51.2 | v40.64,23.57 32.11,32.11 S43.2 31.9,32.31 31.29,32.92 v31.29,33.33 | v31.29,41.05 31.9,41.66 31.9,46.13 S35.2 | v32.11,54.46 32.11,60.15 S27.2 | v32.11,68.48 32.11,74.17 S19.2 | v32.11,82.5 32.11,87.99 S11.2 | v32.11,96.52 32.11,102.01 S3.2
  Bottom 0.254: v54.05,6.5 55.07,7.52 55.07,8.33 IC2.5 55.07,8.53 55.07,9.14 52.63,11.58 v49.58,11.58 49.58,10.36 48.77,9.55 47.75,9.55 40.64,16.66 v40.64,23.57 | v31.29,33.33 v31.29,41.05 31.29,43.08 32.72,44.5 32.72,51.21 32.11,51.82 v32.11,54.46 v32.11,68.48 v32.11,82.5 v32.11,96.52
BUTTON_MATRIX_COLLUM4  (via drill 0.35)
  Top 0.254: v58.52,5.69 47.55,5.69 46.13,4.27 S60.2 | v50.39,10.57 50.39,11.79 46.13,16.05 46.13,18.09 S52.2 45.92,18.29 v45.92,20.12 | v45.92,26.42 45.92,32.11 S44.2 | v44.5,44.7 45.92,46.13 S36.2 | v45.92,55.68 45.92,60.15 S28.2 | v45.92,68.48 45.92,74.17 S20.2 | v45.92,82.5 45.92,87.99 S12.2 | v45.92,96.52 45.92,102.01 S4.2
  Bottom 0.254: IC2.1 60.15,8.33 60.15,7.32 v58.52,5.69 56.08,3.25 54.66,3.25 50.39,7.52 v50.39,10.57 | v45.92,20.12 v45.92,26.42 36.37,26.42 32.92,29.87 32.92,31.5 44.5,43.08 v44.5,44.7 41.05,48.16 41.05,50.8 v45.92,55.68 v45.92,68.48 v45.92,82.5 v45.92,96.52
BUTTON_MATRIX_COLLUM5  (via drill 0.35)
  Top 0.254: 59.54,18.69 v58.52,18.69 | 59.54,18.69 59.94,18.29 S53.2 | v62.79,6.91 60.15,4.27 S61.2 | v65.23,11.79 65.23,13.01 60.15,18.09 S53.2 | 59.54,18.69 59.94,19.1 59.94,21.54 59.13,22.35 59.13,25.2 59.94,26.01 59.94,32.11 S45.2 60.15,32.31 60.76,32.31 v61.57,33.12 | 59.54,18.69 S53.2 | v60.15,49.78 60.15,46.33 S37.2 | v60.15,58.32 60.15,60.15 S29.2 | v59.54,68.07 59.94,68.48 59.94,74.17 S21.2 | v59.94,82.91 59.94,87.99 S13.2 | v59.94,96.52 59.94,102.01 S5.2
  Bottom 0.254: v58.52,18.69 55.27,15.44 55.27,14.63 IC2.12 | v62.79,6.91 62.79,7.32 65.23,9.75 v65.23,11.79 | v59.94,96.52 v59.94,82.91 59.94,82.5 58.93,81.48 58.93,68.68 v59.54,68.07 62.99,64.62 62.99,61.16 v60.15,58.32 v60.15,49.78 61.57,48.36 v61.57,33.12
BUTTON_MATRIX_COLLUM6  (via drill 0.35)
  Top 0.254: S6.2 74.17,102.01 75.18,100.99 75.18,95.1 74.37,94.28 74.37,93.67 75.18,92.86 75.39,92.86 76.81,94.28 79.05,94.28 81.08,92.25 81.08,90.63 78.64,88.19 74.17,88.19 S14.2 73.97,87.99 73.97,82.09 72.95,81.08 72.95,80.26 72.34,79.65 v70.92,79.65 | v74.17,21.74 74.17,18.29 S54.2 74.17,18.09 v74.17,13.61 | v74.17,9.35 74.17,4.27 S62.2 | v73.97,29.46 73.97,32.11 S46.2 | v73.97,40.44 73.97,46.13 S38.2 | v72.75,54.66 73.97,55.88 73.97,60.15 S30.2 73.97,60.35 73.56,60.76 v73.56,61.57 | v73.97,68.48 73.97,74.17 S22.2
  Bottom 0.254: v74.17,21.74 71.93,21.74 | 71.93,21.74 70.51,21.74 69.29,20.52 54.86,20.52 50.8,16.46 50.8,13.21 58.32,13.21 58.93,13.82 58.93,14.43 IC2.15 | v74.17,13.61 v74.17,9.35 | 71.93,21.74 71.93,25.2 73.97,27.23 v73.97,29.46 v73.97,40.44 72.75,41.66 v72.75,54.66 | v73.56,61.57 73.97,61.98 v73.97,68.48 70.92,71.53 v70.92,79.65
BUTTON_MATRIX_COLLUM7  (via drill 0.35)
  Top 0.254: v68.07,15.85 v64.82,15.85 | v87.17,16.66 87.17,17.27 87.99,18.09 S55.2 | v89.41,8.74 88.19,7.52 88.19,4.27 S63.2 | v91.03,25.2 88.19,28.04 88.19,32.11 S47.2 88.19,32.31 v89.81,33.93 | v89.61,47.75 88.19,46.33 S39.2 88.19,46.13 90.63,43.69 v90.63,41.66 | v89.61,50.39 87.17,52.83 87.17,59.33 87.99,60.15 S31.2 | 91.24,74.37 96.52,74.37 100.79,78.64 100.79,78.84 91.64,87.99 88.19,87.99 S15.2 87.99,88.19 v87.99,90.02 | 91.24,74.37 88.19,74.37 S23.2 | v87.99,96.52 87.99,102.01 S7.2 | 91.24,74.37 v91.24,71.12
  Bottom 0.254: v64.82,15.85 58.52,15.85 57.91,15.24 57.91,14.63 IC2.14 | 86.36,15.85 v68.07,15.85 | 86.36,15.85 v87.17,16.66 88.8,16.66 91.64,19.51 91.64,21.74 91.03,22.35 v91.03,25.2 | v89.41,8.74 89.41,12.8 86.36,15.85 | v89.61,47.75 v89.61,50.39 87.58,52.43 87.38,52.43 87.17,52.63 87.17,55.07 91.24,59.13 v91.24,71.12 | v87.99,90.02 v87.99,96.52 | v89.81,33.93 89.81,37.8 90.63,38.61 v90.63,41.66
BUTTON_MATRIX_COLLUM8  (via drill 0.35)
  Top 0.254: v103.02,50.8 102.21,49.99 102.21,46.33 S40.2 | v103.02,58.52 103.02,59.33 102.21,60.15 S32.2 102.01,60.35 101.19,61.16 v100.99,61.16 | 102.82,87.38 102.21,87.99 S16.2 | 102.82,87.38 103.23,86.97 103.23,81.08 102.21,80.06 102.21,74.37 S24.2 102.21,74.17 103.23,73.15 103.23,67.26 v101.8,65.84 | 102.82,87.38 108.31,92.86 106.88,94.28 106.48,94.28 104.65,92.46 103.02,92.46 100.99,94.49 100.99,95.1 102.01,96.11 102.01,102.01 S8.2 | v102.62,6.91 102.21,6.5 102.21,4.27 S64.2 | v102.62,16.66 102.62,17.68 102.21,18.09 S56.2 | v90.42,28.04 95.3,28.04 95.5,28.25 | 95.5,28.25 98.75,31.5 101.4,31.5 102.01,32.11 S48.2 102.21,32.31 v100.18,34.34 | 95.5,28.25 v99.16,24.59
  Bottom 0.254: v103.02,58.52 v103.02,50.8 | v101.8,65.84 100.99,65.02 v100.99,61.16 100.99,45.11 100.18,44.3 v100.18,34.34 | v102.62,6.91 v102.62,16.66 102.62,21.13 v99.16,24.59 | v90.42,28.04 88.39,28.04 81.28,20.93 70.31,20.93 68.28,18.9 60.35,18.9 56.69,15.24 56.69,14.63 IC2.13
BUTTON_MATRIX_OUT  (via drill 0.35)
  Top 0.254: v132.89,21.95 132.89,35.56 136.35,39.01 136.35,42.06 138.79,44.5 141.22,44.5 143.05,46.33 143.05,60.15 141.43,61.77 141.43,62.18 U$3.D7
  Bottom 0.254: 58.93,10.16 57.91,9.14 57.91,8.53 IC2.3 | 58.93,10.16 59.33,10.57 63.4,10.57 R1.1 | v132.89,21.95 132.89,16.87 131.27,15.24 127.61,15.24 120.48,8.11 120.48,6.5 117.03,3.05 74.98,3.05 64.41,13.61 62.82,13.61 61.2,11.99 58.73,11.99 58.12,11.38 58.12,10.97 58.93,10.16
BUTTON_MATRIX_ROW1  (via drill 0.35)
  Top 0.254: S1.1 8.53,106.48 14.63,106.48 15.44,105.66 16.05,105.66 16.87,106.48 22.35,106.48 S2.1 22.55,106.48 23.37,105.66 29.67,105.66 30.48,106.48 36.37,106.48 S3.1 36.58,106.48 37.39,105.66 43.69,105.66 44.5,106.48 50.39,106.48 S4.1 50.6,106.48 56.69,106.48 57.51,105.66 57.91,105.66 58.73,106.48 64.41,106.48 S5.1 | 64.62,105.66 64.62,106.48 S5.1 | 64.62,105.66 v64.62,104.65 | 64.62,105.66 71.73,105.66 72.54,106.48 78.44,106.48 S6.1 78.64,106.48 79.45,105.66 85.75,105.66 86.56,106.48 88.39,106.48 | 64.62,105.66 S5.1 | 88.39,106.48 92.46,106.48 S7.1 | 88.39,106.48 88.39,108.1 90.42,110.13 111.35,110.13 114.61,106.88 114.61,106.48 113.79,105.66 113.39,105.66 112.57,106.48 106.68,106.48 S8.1
  Bottom 0.254: v64.62,104.65 64.62,85.55 59.74,80.67 59.74,69.7 84.33,45.11 85.75,45.11 IC1.3
BUTTON_MATRIX_ROW2  (via drill 0.35)
  Top 0.254: S9.1 8.53,92.46 14.63,92.46 15.44,91.64 16.05,91.64 16.87,92.46 22.35,92.46 S10.1 22.55,92.46 23.37,91.64 29.67,91.64 30.48,92.46 36.37,92.46 S11.1 36.58,92.46 42.67,92.46 43.48,91.64 43.89,91.64 44.7,92.46 50.39,92.46 S12.1 50.6,92.46 56.69,92.46 58.73,90.42 63.8,90.42 | S16.1 106.48,92.46 106.07,92.05 102.82,92.05 102.41,92.46 100.79,92.46 99.97,91.64 99.57,91.64 98.75,92.46 92.66,92.46 S15.1 92.46,92.46 89,92.46 86.97,90.42 v84.33,90.42 | 63.8,90.42 63.8,91.85 64.41,92.46 S13.1 64.62,92.46 65.43,91.64 71.73,91.64 72.54,92.46 78.44,92.46 S14.1 78.64,92.46 v80.26,90.83 | 63.8,90.42 v63.8,85.75
  Bottom 0.254: v63.8,85.75 59.33,81.28 59.33,69.49 84.94,43.89 85.75,43.89 IC1.2 | v84.33,90.42 80.67,90.42 v80.26,90.83
BUTTON_MATRIX_ROW3  (via drill 0.35)
  Top 0.254: S17.1 8.53,78.64 14.43,78.64 15.44,79.65 18.49,79.65 19.51,78.64 22.35,78.64 S18.1 22.55,78.44 23.37,77.62 29.67,77.62 30.48,78.44 36.37,78.44 S19.1 36.58,78.44 37.39,77.62 43.69,77.62 44.5,78.44 50.39,78.44 S20.1 50.6,78.44 51.41,77.62 57.71,77.62 58.52,78.44 64.41,78.44 S21.1 64.62,78.44 v64.62,71.32 | v77.83,76.81 77.83,77.83 78.44,78.44 S22.1 78.64,78.44 79.45,77.62 85.75,77.62 86.56,78.44 92.46,78.44 S23.1 | v104.65,76.61 106.48,78.44 S24.1
  Bottom 0.254: v77.83,76.81 77.83,61.57 | 77.83,61.57 77.83,60.76 | IC1.4 85.75,46.53 83.52,46.53 78.52,51.53 78.46,51.59 77.79,52.26 77.79,52.98 78.46,53.66 78.46,60.12 77.83,60.76 | v104.65,76.61 94.49,76.61 79.45,61.57 77.83,61.57 | v64.62,71.32 64.62,69.49 73.36,60.76 77.83,60.76
BUTTON_MATRIX_ROW4  (via drill 0.35)
  Top 0.254: S25.1 8.53,64.62 14.43,64.62 15.44,63.6 15.85,63.6 16.87,64.62 22.35,64.62 S26.1 22.55,64.62 23.57,63.6 29.67,63.6 30.68,64.62 36.37,64.62 S27.1 36.58,64.62 37.59,63.6 43.69,63.6 44.7,64.62 50.39,64.62 S28.1 50.6,64.62 55.68,64.62 v55.88,64.41 | S32.1 106.48,64.62 106.27,64.41 100.79,64.41 99.97,63.6 99.57,63.6 98.55,64.62 92.66,64.62 S31.1 92.46,64.62 v90.42,62.59 | v84.53,53.65 84.53,61.37 84.73,61.57 84.73,61.98 82.09,64.62 78.64,64.62 S30.1 78.44,64.62 72.95,64.62 71.93,63.6 71.53,63.6 70.51,64.62 64.62,64.62 S29.1 64.41,64.62 64.21,64.41 v62.18,64.41
  Bottom 0.254: v84.53,53.65 84.53,51.41 | 84.53,51.41 84.53,50.8 85.14,50.19 85.75,50.19 IC1.7 | v90.42,62.59 90.42,58.93 86.36,54.86 81.69,54.86 79.25,52.43 79.25,52.02 79.86,51.41 84.53,51.41 | v62.18,64.41 v55.88,64.41
BUTTON_MATRIX_ROW5  (via drill 0.35)
  Top 0.254: S33.1 8.53,50.8 14.63,50.8 15.65,51.82 18.29,51.82 19.3,50.8 22.35,50.8 S34.1 22.55,50.6 23.57,49.58 29.67,49.58 30.68,50.6 36.37,50.6 S35.1 36.58,50.6 v42.27,50.6 | S39.1 92.66,50.8 v93.67,49.78 93.88,49.58 99.57,49.58 103.02,53.03 103.43,53.03 105.66,50.8 106.48,50.8 S40.1 | v80.06,52.22 78.64,50.8 S38.1 78.44,50.6 77.42,50.6 77.01,50.19 73.36,50.19 73.15,50.39 72.54,50.39 71.73,49.58 65.63,49.58 64.62,50.6 S37.1 64.41,50.6 58.93,50.6 56.9,48.56 54.05,48.56 52.02,50.6 50.6,50.6 S36.1 50.39,50.6 v48.56,50.6
  Bottom 0.254: v93.67,49.78 93.47,49.99 92.05,49.99 IC1.10 91.85,49.99 91.24,49.99 90.42,49.17 90.42,47.55 89.81,46.94 89.41,46.94 88.8,47.55 88.8,50.39 84.73,54.46 82.3,54.46 v80.06,52.22 | v48.56,50.6 v42.27,50.6
BUTTON_MATRIX_ROW6  (via drill 0.35)
  Top 0.254: S48.1 106.48,36.58 106.07,36.17 102.62,36.17 102.21,36.58 100.99,36.58 99.97,35.56 99.57,35.56 98.55,36.58 92.66,36.58 S47.1 92.46,36.78 89.41,36.78 88.39,37.8 88.39,38.41 89.2,39.22 89.2,39.62 87.38,41.45 v87.38,42.27 | S41.1 8.53,36.58 14.63,36.58 15.65,35.56 15.85,35.56 16.87,36.58 22.35,36.58 S42.1 22.55,36.78 23.16,36.78 v23.98,37.59 | v80.47,37.19 79.05,37.19 78.64,36.78 S46.1 78.44,36.58 72.54,36.58 71.53,35.56 65.63,35.56 64.62,36.58 S45.1 64.41,36.58 58.73,36.58 57.71,35.56 51.61,35.56 50.6,36.58 S44.1 50.39,36.58 44.91,36.58 43.89,35.56 43.48,35.56 42.47,36.58 36.58,36.58 S43.1 36.37,36.58 34.14,34.34 v30.48,34.34
  Bottom 0.254: v80.47,37.19 IC1.1 85.95,42.47 86.16,42.27 v87.38,42.27 | v23.98,37.59 27.23,37.59 v30.48,34.34
BUTTON_MATRIX_ROW7  (via drill 0.35)
  Top 0.254: v14.43,22.76 8.53,22.76 S49.1 | v20.73,22.76 22.35,22.76 S50.1 22.55,22.55 23.37,21.74 29.87,21.74 30.68,22.55 36.37,22.55 S51.1 36.58,22.55 37.39,21.74 43.89,21.74 44.7,22.55 46.33,22.55 | 46.33,22.55 50.39,22.55 S52.1 | S56.1 106.48,22.76 104.24,24.99 103.43,24.99 100.18,21.74 99.36,21.74 98.55,22.55 92.66,22.55 S55.1 92.46,22.55 v87.99,22.55 | v84.12,47.55 75.59,39.01 75.39,39.01 74.37,38 74.37,37.8 75.18,36.98 77.22,36.98 78.64,38.41 80.26,38.41 81.28,37.39 81.28,30.89 75.59,25.2 | 74.37,23.98 75.59,25.2 | 74.37,23.98 74.37,23.77 75.39,22.76 78.44,22.76 S54.1 78.64,22.55 v83.92,22.55 | 74.37,23.98 72.14,21.74 71.32,21.74 70.51,22.55 64.62,22.55 S53.1 | 46.33,22.55 46.33,23.98 56.29,33.93 66.24,33.93 73.97,26.21 74.57,26.21 75.59,25.2
  Bottom 0.254: v20.73,22.76 v14.43,22.76 | v84.12,47.55 85.75,47.55 IC1.5 | v83.92,22.55 v87.99,22.55
BUTTON_MATRIX_ROW8  (via drill 0.35)
  Top 0.254: v87.99,48.77 89.81,48.77 v95.3,43.28 | v102.01,29.46 109.32,22.15 109.32,11.38 106.68,8.74 S64.1 106.48,8.53 103.02,8.53 101.8,9.75 99.57,9.75 98.55,8.74 92.66,8.74 S63.1 92.46,8.74 91.85,8.74 89.61,10.97 89,10.97 87.78,9.75 79.65,9.75 78.64,8.74 S62.1 78.44,8.74 77.83,8.74 75.59,10.97 74.98,10.97 74.17,10.16 66.04,10.16 64.62,8.74 S61.1 64.41,8.74 63.8,8.74 61.57,10.97 60.96,10.97 59.74,9.75 51.61,9.75 50.6,8.74 S60.1 50.39,8.74 49.78,8.74 47.55,10.97 46.94,10.97 45.72,9.75 37.59,9.75 36.58,8.74 S59.1 36.37,8.74 35.76,8.74 33.53,10.97 33.12,10.97 31.9,9.75 23.57,9.75 22.55,8.74 S58.1 22.35,8.74 20.12,10.97 19.3,10.97 16.05,7.72 15.44,7.72 14.63,8.53 8.53,8.53 S57.1
  Bottom 0.254: v87.99,48.77 85.95,48.77 IC1.6 | v95.3,43.28 99.36,39.22 99.36,32.11 v102.01,29.46
BUTTON_MATRIX_ROW_CLOCK  (via drill 0.35)
  Top 0.254: v96.52,47.95 v94.49,45.92 | v124.16,76.81 v121.51,74.17
  Bottom 0.254: v94.49,45.92 93.67,45.11 92.05,45.11 IC1.14 | v96.52,47.95 96.52,48.97 100.38,52.83 100.38,60.76 100.18,60.96 100.18,65.23 109.12,74.17 v121.51,74.17 | v124.16,76.81 124.77,76.81 125.17,76.4 128.42,76.4 130.05,74.78 130.25,74.78 139.6,65.43 139.6,61.57 141.22,59.94 U$3.D8
BUTTON_MATRIX_ROW_RESET
  Bottom 0.254: D2.A 97.94,51.82 97.94,64.21 109.73,76 127.81,76 129.84,73.97 U$3.A4
CLOCK_IN  (via drill 0.35)
  Top 0.254: v135.94,36.37 135.94,38 138.18,40.23 138.18,42.27 139.19,43.28 CLOCK_IN.P$1 139.4,43.48 140.82,43.48 143.46,46.13 143.46,69.9 141.43,71.93 141.43,72.34 U$3.D3
  Bottom 0.254: v135.94,36.37 133.3,33.73 132.69,33.73 IC5.12
CLOCK_OUT
  Bottom 0.254: IC5.13 132.49,32.31 131.88,32.31 127.81,28.25 127.81,28.04 127.61,27.84 125.37,27.84 112.17,41.05 107.7,41.05 106.27,42.47 IC6.1
CLOCK_RESET_SWITCH
  Bottom 0.254: IC5.10 132.69,36.17 132.69,34.95 IC5.11 132.49,34.75 131.88,34.75 127.61,30.48 124.77,30.48 113.39,41.86 111.15,41.86 108.1,44.91 106.27,44.91 IC6.3
COMM_A  (via drill 0.35)
  Top 0.254: v58.93,11.18 v54.05,16.05 | v111.35,2.23 123.55,14.43 v123.55,27.84 123.55,39.42 122.33,40.64 122.33,63.2 124.97,65.84 126.59,65.84 130.86,70.1 v130.86,75.18 | v98.15,38.61 100.79,38.61 102.82,36.58 104.85,36.58 106.68,38.41 109.93,38.41 110.74,37.59 v110.74,34.95
  Bottom 0.254: v54.05,16.05 54.05,14.63 IC2.11 | v58.93,11.18 60.96,11.18 62.99,13.21 64.21,13.21 64.41,13.01 64.41,9.55 61.98,7.11 61.98,6.71 66.45,2.23 v111.35,2.23 | v123.55,27.84 119.89,27.84 112.98,34.75 112.37,34.75 IC7.11 112.17,34.95 v110.74,34.95 | v98.15,38.61 94.49,34.95 92.05,34.95 IC3.11 | v130.86,75.18 135.94,70.1 141.22,70.1 U$3.D4
COMM_B  (via drill 0.35)
  Top 0.254: v60.96,19.71 60.96,23.16 60.35,23.77 60.35,23.98 61.37,24.99 v72.75,24.99 | v90.42,30.68 90.42,32.51 v93.67,35.76 96.11,33.33 v100.18,33.33 | v109.93,36.17 108.31,36.17 106.48,34.34 | v101.19,34.34 106.48,34.34 | v131.06,37.19 135.53,41.66 135.53,51.61 135.94,52.02 135.94,61.57 141.22,66.85 141.22,67.26 U$3.D5 | v121.51,35.36 121.51,25.2 118.26,21.95 118.26,12.19 116.23,10.16 116.03,10.16 114.2,11.99 114.2,17.27 113.39,18.09 113.39,21.34 114.61,22.55 114.61,23.57 106.48,31.7 106.48,34.34
  Bottom 0.254: v60.96,19.71 56.69,19.71 52.83,15.85 52.83,14.63 IC2.10 | v72.75,24.99 84.73,24.99 v90.42,30.68 | v93.67,35.76 92.46,35.76 92.05,36.17 IC3.10 | v109.93,36.17 112.17,36.17 IC7.10 | v100.18,33.33 v101.19,34.34 | v131.06,37.19 128.63,37.19 127.61,38.2 124.36,38.2 v121.51,35.36
COMM_C  (via drill 0.35)
  Top 0.254: v57.1,21.74 v55.07,19.71 | v73.15,28.04 73.56,28.04 v80.47,34.95 | v109.93,37.39 108.92,37.39 106.48,34.95 104.85,34.95 v104.44,35.36 | v93.88,39.42 v100.99,39.42
  Bottom 0.254: v55.07,19.71 51.61,16.26 51.61,14.63 IC2.9 | 63.2,21.74 66.85,21.74 v73.15,28.04 | 63.2,21.74 v57.1,21.74 | v80.47,34.95 81.89,36.37 83.72,36.37 84.53,35.56 87.17,35.56 89.61,33.12 90.02,33.12 90.63,33.73 90.63,36.78 91.24,37.39 91.85,37.39 IC3.9 92.05,37.59 v93.88,39.42 | v109.93,37.39 112.17,37.39 IC7.9 | v104.44,35.36 104.44,35.97 v100.99,39.42 | 63.2,21.74 63.2,22.76 60.76,25.2 60.76,45.72 55.07,51.41 55.07,96.11 64.41,105.46 90.22,105.46 102.62,93.07 136.75,93.07 143.46,86.36 143.46,67.46 141.43,65.43 141.43,65.02 U$3.D6
DAC_CS
  Bottom 0.254: U$2.2 106.27,56.69 105.87,56.69 104.44,55.27 104.44,46.13 104.85,45.72 108.27,45.72 110.17,43.81 IC6.15
DAC_DATA
  Bottom 0.254: U$2.15 112.17,56.9 117.04,56.9 117.86,57.71 117.86,64.21 125.98,72.34 U$3.A2
DAC_LDAC
  Bottom 0.254: U$2.1 106.27,56.08 104.85,54.66 104.85,48.36 105.46,47.75 106.07,47.75 IC6.5
DTR
  Bottom 0.254: C26.2 63.6,79.65 63.6,80.87 65.43,82.7 66.04,82.7 IC8.2
ENC_A
  Top 0.254: U$3.D2 141.43,75.18 146.71,75.18 147.52,76 147.52,87.38 142.65,92.25 142.65,99.16 S73.A
ENC_B
  Top 0.254: U$3.D11 126.19,59.94 126.19,60.35 138.79,72.95 138.79,100.58 142.44,104.24 S73.B
ENC_SWITCH
  Top 0.254: U$3.D12 126.19,62.38 126.19,62.99 131.67,68.48 131.67,83.92 128.83,86.77 128.83,98.55 128.22,99.16 S73.SW-
GND  (via drill 0.35)
  Top 0.254: v113.79,6.3 114.81,7.32 LED65.4 | C22.1 120.09,96.72 120.09,93.07 120.5,92.66 S71.1 120.5,92.46 120.5,90.42 | v117.65,77.62 115.01,77.62 LED70.4 | v111.76,77.62 108.51,74.37 108.51,73.36 C16.2 | S69.1 120.7,64.82 120.7,76.81 v121.51,77.62 120.7,78.44 S70.1 120.5,78.64 119.69,79.45 119.69,83.31 120.5,84.12 120.5,90.42 | LED24.4 102.01,81.28 102.01,86.16 100.38,87.78 v100.38,90.42 100.38,91.03 100.79,91.44 LED9.4 | v115.21,90.42 115.01,90.63 115.01,91.44 LED71.4 | v82.5,86.77 87.99,81.28 LED23.4 | v90.22,93.27 89.81,92.86 88.8,92.86 87.58,91.64 86.97,91.64 LED10.4 | v119.89,90.42 120.5,90.42 | LED28.4 58.93,63.4 63.6,63.4 64.21,62.79 72.14,62.79 72.75,63.4 LED27.4 72.95,63.4 77.62,63.4 78.23,62.79 78.64,62.79 79.05,63.2 79.45,63.2 80.06,62.59 80.06,58.93 77.01,55.88 v76.83,55.88 76.81,55.88 74.17,53.24 LED38.4 73.97,53.24 60.15,53.24 LED37.4 | v88.19,54.46 88.19,53.24 LED39.4 | v82.23,50.16 82.09,50.19 82.09,51.61 81.69,52.02 v81.6,52.07 | v86.77,62.18 86.77,63.4 LED26.4 | v83.72,60.55 83.72,54.25 83.31,53.85 v83.19,53.66 | 90.63,61.77 91.64,62.79 v98.75,62.79 99.77,62.79 100.38,63.4 100.79,63.4 LED25.4 | v89,61.77 90.63,61.77 | v99.57,53.24 102.01,53.24 LED40.4 | 90.63,61.77 v92.05,60.35 | v85.34,52.43 84.53,52.43 83.31,53.65 v83.19,53.66 | v77.47,54.29 77.62,54.25 82.7,54.25 83.11,53.85 v83.19,53.66 | 30.28,88.39 30.28,90.83 30.89,91.44 LED14.4 | 30.28,88.39 30.28,83.11 32.11,81.28 LED19.4 32.31,81.28 42.67,81.28 44.3,82.91 | LED17.4 4.27,81.28 5.08,81.28 15.04,91.24 16.66,91.24 16.87,91.44 LED15.4 17.07,91.44 17.48,91.44 19.91,89 19.91,88.39 | 19.91,88.39 18.29,86.77 18.29,81.28 LED18.4
  Top 0.254: 19.91,88.39 30.28,88.39 | v68.68,93.67 67.46,94.89 61.16,94.89 58.93,92.66 58.93,91.64 LED12.4 | v75.39,82.5 74.17,81.28 LED22.4 | 44.3,82.91 45.92,81.28 LED20.4 46.13,81.28 59.94,81.28 LED21.4 60.15,81.28 61.98,81.28 63.8,83.11 | 44.3,82.91 44.3,91.03 44.7,91.44 LED13.4 | 63.8,83.11 66.85,86.16 | 66.85,86.16 v69.9,89.2 72.14,91.44 72.75,91.44 LED11.4 72.95,91.64 v74.17,91.64 | 63.8,83.11 v67.26,79.65 | 66.85,86.16 67.06,86.16 v67.67,85.55 69.09,84.12 v71.12,84.12 | v73.36,6.5 72.95,6.91 72.95,7.32 LED59.4 72.75,7.32 65.43,7.32 63.4,5.28 v62.18,5.28 | v85.95,6.5 86.77,7.32 LED58.4 | v55.07,6.5 55.88,7.32 58.73,7.32 LED60.4 58.93,7.32 58.93,6.3 59.33,5.89 59.33,5.69 | LED64.4 3.05,7.32 7.72,7.32 8.13,6.91 16.46,6.91 16.87,7.32 LED63.4 17.07,7.32 17.48,7.32 18.29,6.5 22.55,6.5 23.37,7.32 30.89,7.32 LED62.4 31.09,7.32 v32.11,7.32 | v37.8,7.32 44.7,7.32 LED61.4 | v14.63,20.12 11.79,17.27 10.57,17.27 C20.2 | 59.33,5.69 59.33,5.49 57.1,3.25 v48.36,3.25 | 59.33,5.69 v59.54,5.69 | v84.12,36.98 v84.12,34.95 84.12,32.72 v79.25,27.84 | 86.36,33.53 86.36,34.95 86.77,35.36 LED42.4 | 86.36,33.53 86.36,29.26 87.99,27.64 v87.99,26.42 87.99,25.2 LED55.4 | v88.8,35.15 88.8,34.75 87.58,33.53 86.36,33.53 | 65.23,25.81 73.36,25.81 73.97,25.2 LED54.4 | 65.23,25.81 61.57,25.81 60.96,25.2 60.15,25.2 LED53.4 | 44.7,34.95 44.7,32.51 44.3,32.11 44.3,26.82 44.5,26.62 | 44.7,34.95 44.7,35.36 LED45.4 44.7,34.95 | 44.5,26.62 45.92,25.2 LED52.4 | 44.7,34.95 54.25,34.95 | 54.25,34.95 57.71,34.95 58.12,35.36 58.73,35.36 LED44.4 58.93,35.36 59.33,34.95 v65.23,34.95 71.53,34.95 71.93,35.36 72.75,35.36 LED43.4 72.95,35.36 75.79,32.51 75.79,32.31 75.39,31.9 v75.39,31.09
  Top 0.254: 54.25,34.95 v54.25,34.75 | v65.23,33.12 65.23,25.81 | 44.5,26.62 v41.66,23.77 | 13.41,31.9 16.87,35.36 LED47.4 | 13.41,31.9 6.71,25.2 4.27,25.2 LED49.4 | 18.09,26.21 18.09,27.23 13.41,31.9 | 18.09,26.21 18.09,25.2 | 18.09,25.2 v16.66,25.2 | 18.09,25.2 LED50.4 | 32.11,26.42 32.11,30.07 29.67,32.51 | 32.11,26.42 32.11,25.2 LED51.4 32.11,24.99 v32.11,23.98 | 29.67,32.51 29.67,34.54 30.48,35.36 30.89,35.36 LED46.4 | v28.45,32.51 29.67,32.51 | v19.1,26.21 18.09,26.21 | 44.3,54.86 44.3,59.74 | 44.3,59.74 44.3,59.94 44.7,60.35 44.7,63.4 LED29.4 | 44.3,54.86 45.92,53.24 LED36.4 46.13,53.03 v46.94,53.85 | 44.3,59.74 v44.09,59.74 | 30.28,55.07 32.11,53.24 LED35.4 32.31,53.24 33.93,54.86 44.3,54.86 | 30.28,55.07 30.28,62.79 30.89,63.4 LED30.4 | 16.26,55.07 18.09,53.24 LED34.4 18.29,53.24 20.12,55.07 30.28,55.07 | 16.26,55.07 16.26,62.79 16.87,63.4 LED31.4 | v3.05,38.61 3.05,35.56 LED48.4 | 5.89,44.3 9.55,44.3 10.36,45.11 C17.2 10.57,45.31 11.38,45.31 16.46,50.39 17.07,50.39 19.51,47.95 v22.15,47.95 v29.67,47.95 | 5.89,44.3 v3.05,44.3 | v3.05,61.16 3.05,63.4 LED32.4 | 5.89,44.3 5.89,46.53 4.27,48.16 4.27,53.03 LED33.4 4.27,53.24 6.1,55.07 16.26,55.07 | v3.05,69.29 6.91,73.15 10.36,73.15 C15.2 | 32.11,26.42 v34.95,26.42 | v108.51,51.41 108.51,49.99 | 108.51,49.99 108.51,45.31 C18.2 108.31,45.11 104.24,41.05 v104.24,40.23 | v103.43,35.36 100.99,35.36 LED41.4 | v93.67,47.14 93.67,45.72 95.3,44.09 v96.72,44.09 | v101.19,41.45 v99.36,41.45 | v121.51,49.58 121.51,49.78 120.7,50.6 S68.1 | 114.81,48.56 114.81,46.53 114.2,45.92 114.2,43.08 120.5,36.78 S67.1 120.7,36.58 120.7,35.15 120.9,34.95 120.9,27.84 120.09,27.03 C21.1 120.09,26.82 120.7,26.21 v120.7,25.4
  Top 0.254: 114.81,48.56 114.81,49.38 LED68.4 | 114.81,48.56 v115.42,48.56 | 108.51,49.99 110.95,49.99 113.79,52.83 v113.79,53.03 | v99.57,7.32 100.79,7.32 LED57.4 100.99,7.52 v100.99,8.94 | 101.6,24.99 100.58,24.99 v99.16,23.57 | 101.6,24.99 102.01,24.99 LED56.4 101.6,24.99 | C19.2 108.51,17.27 v108.51,19.91 107.09,19.91 104.85,22.15 v104.85,22.96 | v119.08,21.13 120.5,22.55 S66.1 | 115.01,22.35 115.01,24.38 112.57,26.82 112.57,32.72 | 115.01,22.35 115.01,21.54 LED66.4 | 112.57,32.72 112.57,36.78 113.59,37.8 113.79,37.8 114.81,36.78 114.81,35.56 LED67.4 | v108.51,30.68 110.54,32.72 112.57,32.72 | 115.01,22.35 v115.62,22.35 | v101.6,24.18 101.6,24.99 | S65.1 120.7,8.74 128.22,8.74 U$4.3 128.42,8.94 130.66,8.94 U$4.4 130.86,8.94 130.86,11.38 U$4.6 | 130.86,13.01 130.86,13.82 U$4.8 | 130.86,13.01 130.86,11.58 U$4.6 | 127.61,34.75 127.61,30.68 127,30.07 127,25.4 | 127.61,34.75 127.61,36.37 | 127.61,36.37 v127.61,40.03 | 127,25.4 v127,22.96 127,15.24 U$4.7 128.22,13.82 128.22,11.58 U$4.5 128.42,11.58 130.66,11.58 U$4.6 | 127.61,34.75 v128.02,34.75 | 127.61,36.37 v128.02,36.37 | 130.86,13.01 139.19,13.01 RESET_OUT.P$3 | 127,25.4 v126.8,25.4 | LED16.4 2.85,91.64 v2.85,100.99 2.85,101.19 0.61,103.43 0.61,106.68 3.05,109.12 4.06,109.12 LED1.4 4.27,109.32 18.09,109.32 LED2.4 18.29,109.32 32.11,109.32 LED3.4 32.31,109.32 45.92,109.32 LED4.4 46.13,109.32 59.94,109.32 LED5.4 60.15,109.32 73.97,109.32 LED6.4 74.17,109.32 87.99,109.32 LED7.4 88.19,109.32 89,109.32 90.22,110.54 114.81,110.54 116.03,109.32 LED72.4 116.23,109.32 117.86,109.32 120.5,106.68 S72.1 120.7,106.48 125.37,101.8 125.58,101.8